# Altium schematic sheet SD_CARD_Sheet1.SchDoc
size A4; SheetNumber: 2; SheetTotal: 11
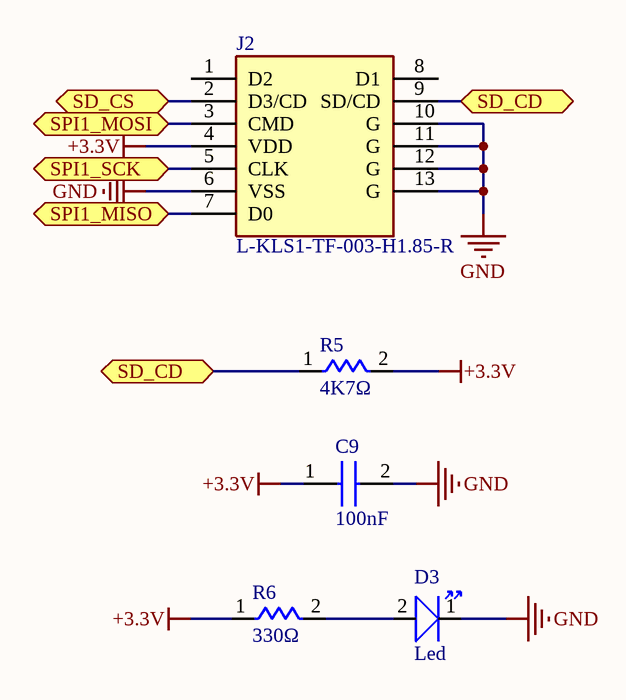
[diagram p0: SD_CARD_Sheet1.SchDoc]

## Parts
C9  100nF  [CAP - 0603]
D3  Led  [LED - 0603]
J2  L-KLS1-TF-003-H1.85-R  [SD CARD L-KLS1-TF-003-H1.85-R]
R5  4K7Ω  [RES - 0603]
R6  330Ω  [RES - 0603]

## Ports
SD_CD (bidir), SD_CS (bidir), SPI1_MISO (bidir), SPI1_MOSI (bidir), SPI1_SCK (bidir)

## Nets
+3.3V: C9.1 J2.4(VDD) R5.2 R6.1
GND: C9.2 D3.1 J2.6(VSS) J2.10(G) J2.11(G) J2.12(G) J2.13(G)
SD_CD: J2.9(SD/CD) R5.1 ; port SD_CD
SD_CS: J2.2(D3/CD) ; port SD_CS
SPI1_MISO: J2.7(D0) ; port SPI1_MISO
SPI1_MOSI: J2.3(CMD) ; port SPI1_MOSI
SPI1_SCK: J2.5(CLK) ; port SPI1_SCK
NetD3_2: D3.2 R6.2

Not connected (* = marked no-connect by the designer): J2 1(D2) 8(D1)

## Library data of the parts
C9 = CAP: Capacitor; ComponentLink1Description: Satın Alma Linki; ComponentLink1URL: https://ozdisan.com/pasif-komponentler/kondansatorler/smt-smd-ve-mlcc-kondansatorler/CL10B472KB8NNNC; ComponentLink2Description: Satın Alma Linki; ComponentLink2URL: https://ozdisan.com/pasif-komponentler/kondansatorler/smt-smd-ve-mlcc-kondansatorler/CL10C200JB8NNNC; ComponentLink3Description: Satın Alma Linki; ComponentLink3URL: https://ozdisan.com/pasif-komponentler/kondansatorler/smt-smd-ve-mlcc-kondansatorler/CL10B104KB8NNNC; ComponentLink4Description: Datasheet; ComponentLink4URL: https://cdn.ozdisan.com/ETicaret_Dosya/448212_5798276.PDF; ComponentLink5Description: Satın Alma Linki; ComponentLink5URL: https://ozdisan.com/pasif-komponentler/kondansatorler/smt-smd-ve-mlcc-kondansatorler/CL10C101JB8NNNC
D3 = Led: HL-PST-1608U51GC - LED SMD 0603 GREEN 500mcd 120° WATER CLEAR; ComponentLink1Description: Satın Alma Linki; ComponentLink1URL: https://ozdisan.com/Product/Detail/471660/HL-PST-1608U51GC; ComponentLink2Description: Datasheet; ComponentLink2URL: https://cdn.ozdisan.com/ETicaret_Dosya/471660_7204356.pdf
J2 = SD CARD L-KLS1-TF-003-H1.85-R: L-KLS1-TF-003-H1.85-R - CONNECTOR MICRO SD CARD SMD KLS; Manufacturer_Name: KLS Electronic; Datasheet Link: https://img.ozdisan.com/ETicaret_Dosya/476392_7149645.pdf; Manufacturer_Part_Number: L-KLS1-TF-003-H1.85-R; ComponentLink1Description: Satın Alma Linki; ComponentLink1URL: https://ozdisan.com/Product/Detail/466548/L-KLS1-TF-003-H1-85-R; ComponentLink2Description: Datasheet; ComponentLink2URL: https://cdn.ozdisan.com/ETicaret_Dosya/466548_2616024.PDF
R5 R6 = Res: SMD Res; ComponentLink1Description: Datasheet; ComponentLink1URL: https://cdn.ozdisan.com/ETicaret_Dosya/570122_9878629.pdf; ComponentLink2Description: Satın Alma Linki; ComponentLink2URL: https://www.ozdisan.com/pasif-komponentler/direncler/smt-smd-direncler/TC0325B3301T5C; ComponentLink3Description: Satın Alma Linki; ComponentLink3URL: https://ozdisan.com/pasif-komponentler/direncler/smt-smd-ve-cip-direncler/0603SAF4701T5E; ComponentLink4Description: Satın Alma Linki; ComponentLink4URL: https://ozdisan.com/pasif-komponentler/direncler/smt-smd-ve-cip-direncler/0805S8F604JT5E; ComponentLink5Description: Satın Alma Linki; ComponentLink5URL: https://ozdisan.com/pasif-komponentler/direncler/smt-smd-ve-cip-direncler/0603SAF1022T5E; ComponentLink6Description: Satın Alma Linki; ComponentLink6URL: https://www.ozdisan.com/pasif-komponentler/direncler/smt-smd-direncler/CQ03SAF0000T5E